# EAGLE design node_board_rony (EAGLE 7.5.0)
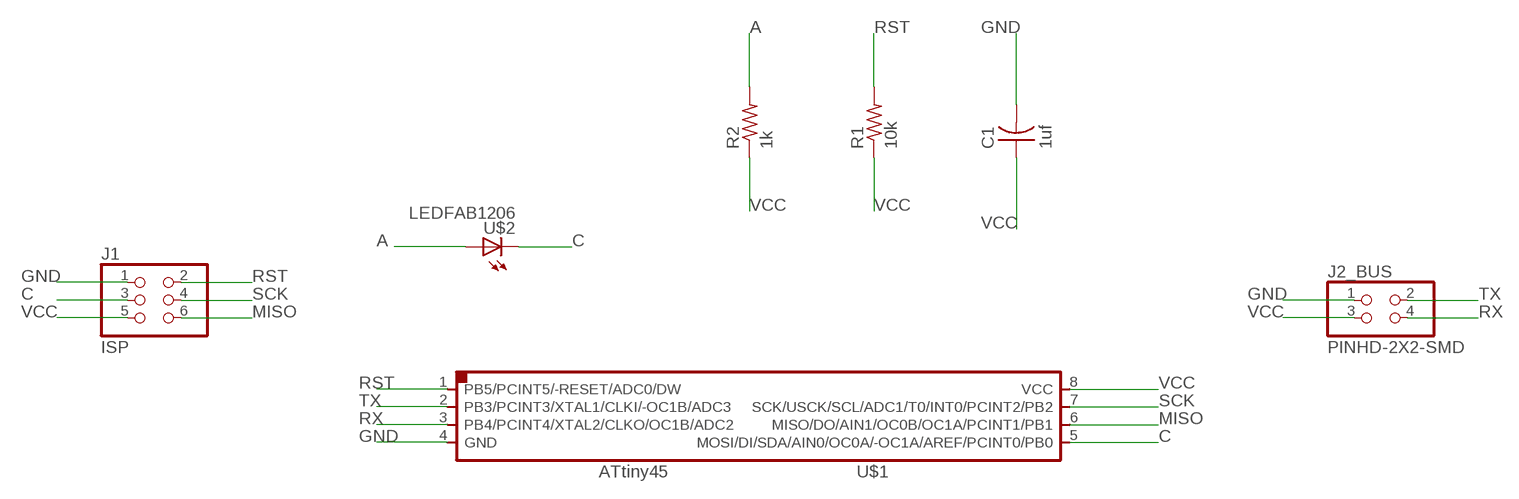
[diagram p0: schematic, sheet 1]

## Parts
C1  1uf  CAP-US1206FAB  [C1206FAB]
J1  ISP  PINHD-2X3-SMD  [2X03SMD]
J2_BUS  PINHD-2X2-SMD  [2X02SMD]
R1  10k  RES-US1206FAB  [R1206FAB]
R2  1k  RES-US1206FAB  [R1206FAB]
U$1  ATTINY45SI  [SOIC8]
U$2  LEDFAB1206  [LED1206FAB]

## Nets
A: R2.2 U$2.1(A)
C: J1.3 U$1.5(MOSI/DI/SDA/AIN0/OC0A/-OC1A/AREF/PCINT0/PB0) U$2.2(C)
GND: C1.2 J1.1 J2_BUS.1 U$1.4(GND)
MISO: J1.6 U$1.6(MISO/DO/AIN1/OC0B/OC1A/PCINT1/PB1)
RST: J1.2 R1.2 U$1.1(PB5/PCINT5/-RESET/ADC0/DW)
RX: J2_BUS.4 U$1.3(PB4/PCINT4/XTAL2/CLKO/OC1B/ADC2)
SCK: J1.4 U$1.7(SCK/USCK/SCL/ADC1/T0/INT0/PCINT2/PB2)
TX: J2_BUS.2 U$1.2(PB3/PCINT3/XTAL1/CLKI/-OC1B/ADC3)
VCC: C1.1 J1.5 J2_BUS.3 R1.1 R2.1 U$1.8(VCC)

## Library data of the parts
C1 = fab:CAP-US
J1 = fab:PINHD-2X3-SMD: PIN HEADER
J2_BUS = fab:PINHD-2X2-SMD
R1 R2 = fab:RES-US: Resistor (US Symbol) Variants with postfix FAB are widened to allow the routing of internal traces
U$1 = fab:ATTINY45
U$2 = fab:LED: LED

## Board
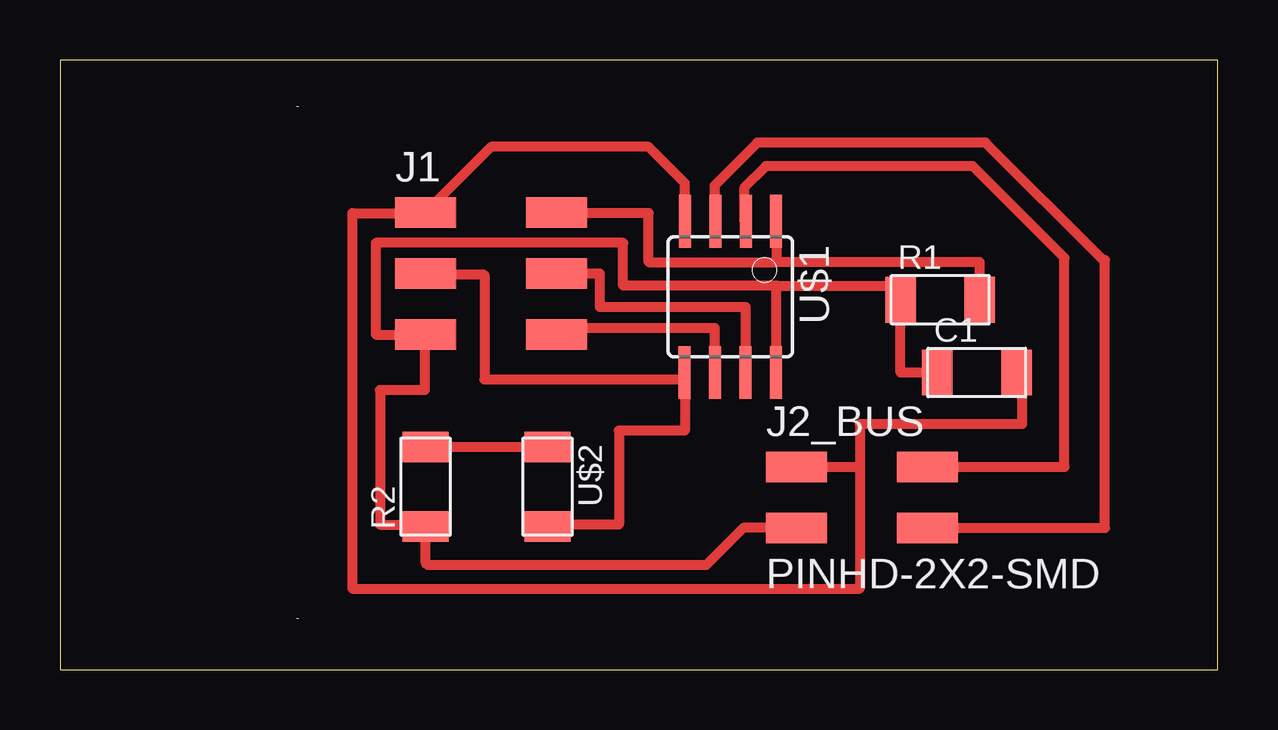
[diagram p1: board, top side]
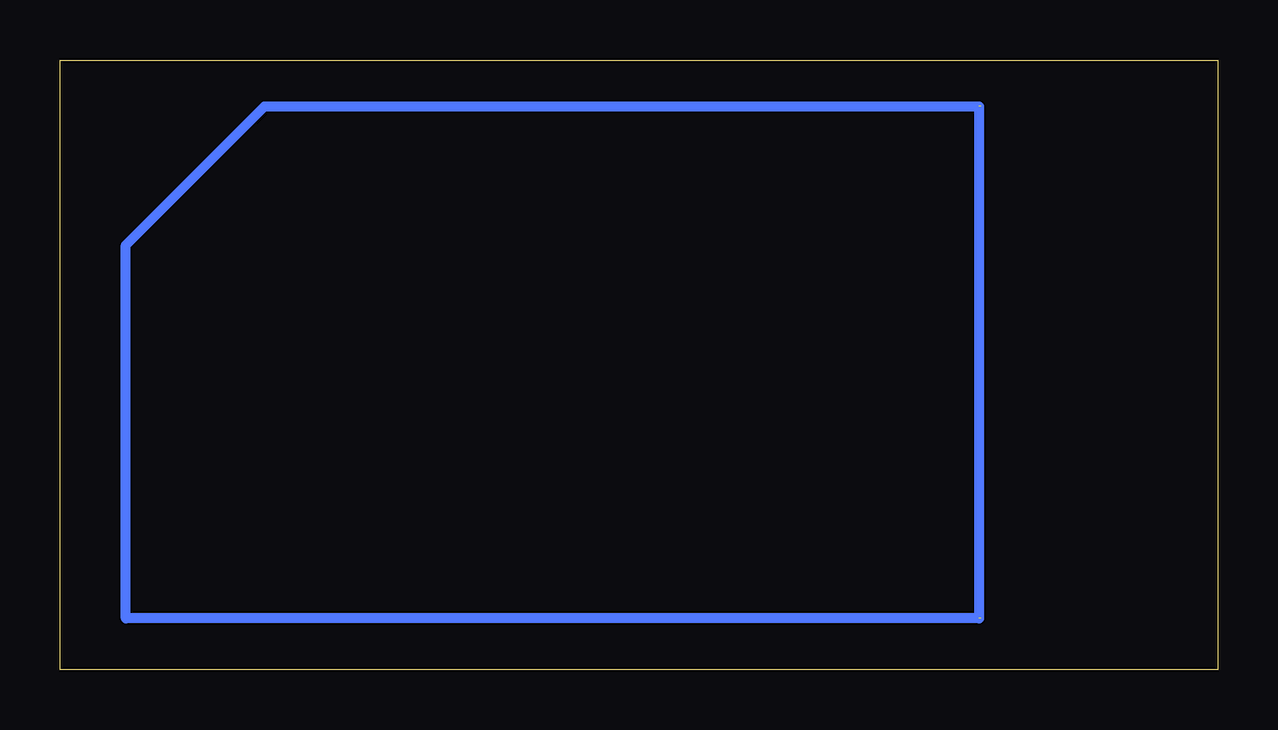
[diagram p2: board, bottom side, seen from below]

Size 48.26 x 25.4 mm. Coordinates in mm from the lower left corner, seen from the top.
Outline: 0,0 48.26,0 48.26,25.4 0,25.4 0,0
Copper layers (1*16): Top 0.035mm / dielectric 1.5mm / Bottom 0.035mm
Design rules "default": minimum track width 10mil, minimum drill 24mil, track to track 8mil, track to pad 8mil, pad to pad 8mil, via to via 8mil, smd to smd 8mil, copper to edge 40mil, drill to drill 8mil, minimum pad ring 10mil, minimum via ring 8mil, stop-mask expansion 4mil, vias tented up to drill 0mil, thermal gap 10mil

### Footprints (pad centres in the part's own frame; a part is rotated, then mirrored left to right if it is on the bottom)
C1206FAB = smd 1.27 x 1.905: 1 -1.651,0; 2 1.651,0
2X03SMD = smd 2.54 x 1.27: 1 -2.54,2.54; 2 2.92,2.54; 3 -2.54,0; 4 2.92,0; 5 -2.54,-2.54; 6 2.92,-2.54
2X02SMD = smd 2.54 x 1.27: 1 -2.54,1.27; 2 2.92,1.27; 3 -2.54,-1.27; 4 2.92,-1.27
R1206FAB = smd 1.27 x 1.905: 1 -1.651,0; 2 1.651,0
SOIC8 = smd 0.5 x 2.2: 1 -1.905,-3.154; 2 -0.645,-3.154; 3 0.625,-3.154; 4 1.895,-3.154; 5 1.905,3.154; 6 0.635,3.154; 7 -0.635,3.154; 8 -1.905,3.154
LED1206FAB = smd 1.27 x 1.905: 1 -1.651,0; 2 1.651,0

### Placement (x,y rotation side)
C1  38.22,12.38 0 top
J1  17.78,16.51 0 top
J2_BUS  33.24,7.18 0 top
R1  36.69,15.41 0 top
R2  15.24,7.62 90 top
U$1  27.94,15.53 180 top
U$2  20.32,7.62 270 top

### Tracks (layer width: path | path; a pad name or v marks a point on that pad's centre or on a via)
A
  Top 0.406: U$2.1 R2.2
C
  Top 0.406: U$2.2 20.32,6.04 23.29,6.04 23.29,9.96 26.05,9.96 U$1.5 26.04,12.09 17.69,12.09 17.69,16.45 15.3,16.45 J1.3
GND
  Top 0.406: U$1.4 26.05,20.27 24.54,21.78 17.97,21.78 J1.1 15.24,19.02 12.18,19.02 12.18,3.38 33.34,3.38 33.34,8.45 | J2_BUS.1 33.34,8.45 | C1.2 40.09,12.82 40.09,10.22 33.34,10.22 33.34,8.45
MISO
  Top 0.406: U$1.6 27.29,14.22 20.7,14.22 J1.6
N$1  (2 unrouted)
  Bottom 0.406: 9.96,2.13 45.52,2.13 45.52,17.69 39.74,23.47 9.96,23.47 9.96,2.13
RST
  Top 0.406: 29.87,19.29 29.87,18.69 U$1.1 29.84,18.61 29.87,18.58 | 29.87,18.58 29.87,16.98 | 29.87,18.58 29.87,19.05 | J1.2 20.7,19.02 24.54,19.02 24.54,16.98 29.87,16.98 | R1.2 38.34,16.98 29.87,16.98
RX
  Top 0.406: U$1.3 27.29,18.69 27.29,20.18 29.07,21.96 38.58,21.96 43.47,17.07 43.56,17.07 43.56,5.91 J2_BUS.4
SCK
  Top 0.406: J1.4 22.49,16.51 22.49,15.11 28.57,15.11 U$1.7
TX
  Top 0.406: U$1.2 28.54,18.69 28.54,20.09 29.43,20.98 38.05,20.98 41.87,17.16 41.87,8.45 J2_BUS.2
VCC
  Top 0.406: 29.87,16 23.47,16 23.47,17.78 13.16,17.78 13.16,13.96 15.24,13.96 J1.5 15.2,13.97 15.2,11.65 13.34,11.65 13.34,6.04 15.24,6.04 R2.1 15.24,4.45 15.33,4.36 26.94,4.36 28.49,5.91 J2_BUS.3 | 29.87,16 35.06,16 R1.1 35.04,12.38 C1.1 | U$1.8 29.87,12.38 29.87,16